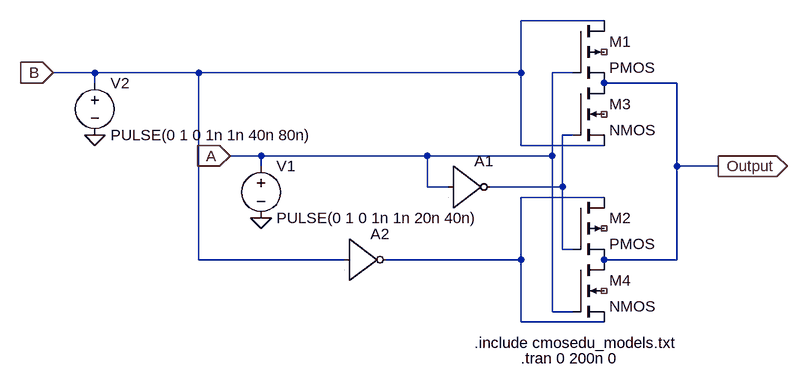
[diagram p0: schematic XOR-TransmissionLogic.asc]
XOR-TransmissionLogic.asc, the LTspice schematic file:
Version 4
SHEET 1 880 680
WIRE 432 64 304 64
WIRE -352 144 -416 144
WIRE -192 144 -352 144
WIRE 304 144 304 64
WIRE 304 144 -192 144
WIRE 384 144 352 144
WIRE -352 160 -352 144
WIRE 544 160 432 160
WIRE 384 240 368 240
WIRE 304 256 304 144
WIRE 432 256 304 256
WIRE -96 272 -144 272
WIRE 160 272 -96 272
WIRE 352 272 352 144
WIRE 352 272 160 272
WIRE -96 288 -96 272
WIRE 544 288 544 160
WIRE 608 288 544 288
WIRE 160 320 160 272
WIRE 192 320 160 320
WIRE 368 320 368 240
WIRE 368 320 256 320
WIRE 432 336 304 336
WIRE 368 416 368 320
WIRE 384 416 368 416
WIRE -192 432 -192 144
WIRE 32 432 -192 432
WIRE 304 432 304 336
WIRE 304 432 96 432
WIRE 544 432 544 288
WIRE 544 432 432 432
WIRE 352 512 352 272
WIRE 384 512 352 512
WIRE 304 528 304 432
WIRE 432 528 304 528
FLAG -144 272 A
IOPIN -144 272 In
FLAG 608 288 Output
IOPIN 608 288 Out
FLAG -416 144 B
IOPIN -416 144 In
FLAG -96 368 0
FLAG -352 240 0
SYMBOL pmos4 384 64 R0
SYMATTR InstName M1
SYMBOL pmos4 384 336 R0
SYMATTR InstName M2
SYMBOL nmos4 384 160 R0
SYMATTR InstName M3
SYMBOL nmos4 384 432 R0
SYMATTR InstName M4
SYMBOL Digital/inv 192 256 R0
SYMATTR InstName A1
SYMBOL Digital/inv 32 368 R0
SYMATTR InstName A2
SYMBOL voltage -96 272 R0
SYMATTR InstName V1
SYMATTR Value PULSE(0 1 0 1n 1n 20n 40n)
SYMBOL voltage -352 144 R0
SYMATTR InstName V2
SYMATTR Value PULSE(0 1 0 1n 1n 40n 80n)
TEXT 232 560 Left 2 !.include cmosedu_models.txt
TEXT 304 584 Left 2 !.tran 0 200n 0

The netlist it stands for:
* XOR-TransmissionLogic.asc
M1 B A Output NC_01 PMOS
M2 N002 N001 Output NC_02 PMOS
M3 Output N001 B NC_03 NMOS
M4 Output A N002 NC_04 NMOS
A1 A 0 0 0 0 N001 0 0 BUF
A2 B 0 0 0 0 N002 0 0 BUF
V1 A 0 PULSE(0 1 0 1n 1n 20n 40n)
V2 B 0 PULSE(0 1 0 1n 1n 40n 80n)
.model NMOS NMOS
.model PMOS PMOS
.lib standard.mos
.include cmosedu_models.txt
.tran 0 200n 0
.backanno
.end